# EasyEDA Pro project solar_panel_5v.eprj

# Schematic Schematic1
Board Name: Board1; Create Date: 2026-05-23; Page Name: P1; Project Name: solar_panel_5v; Schematic Name: Schematic1; Update Date: 2026-06-13; Company: EasyEDA.com; Page Size: A4; Version: V1.0
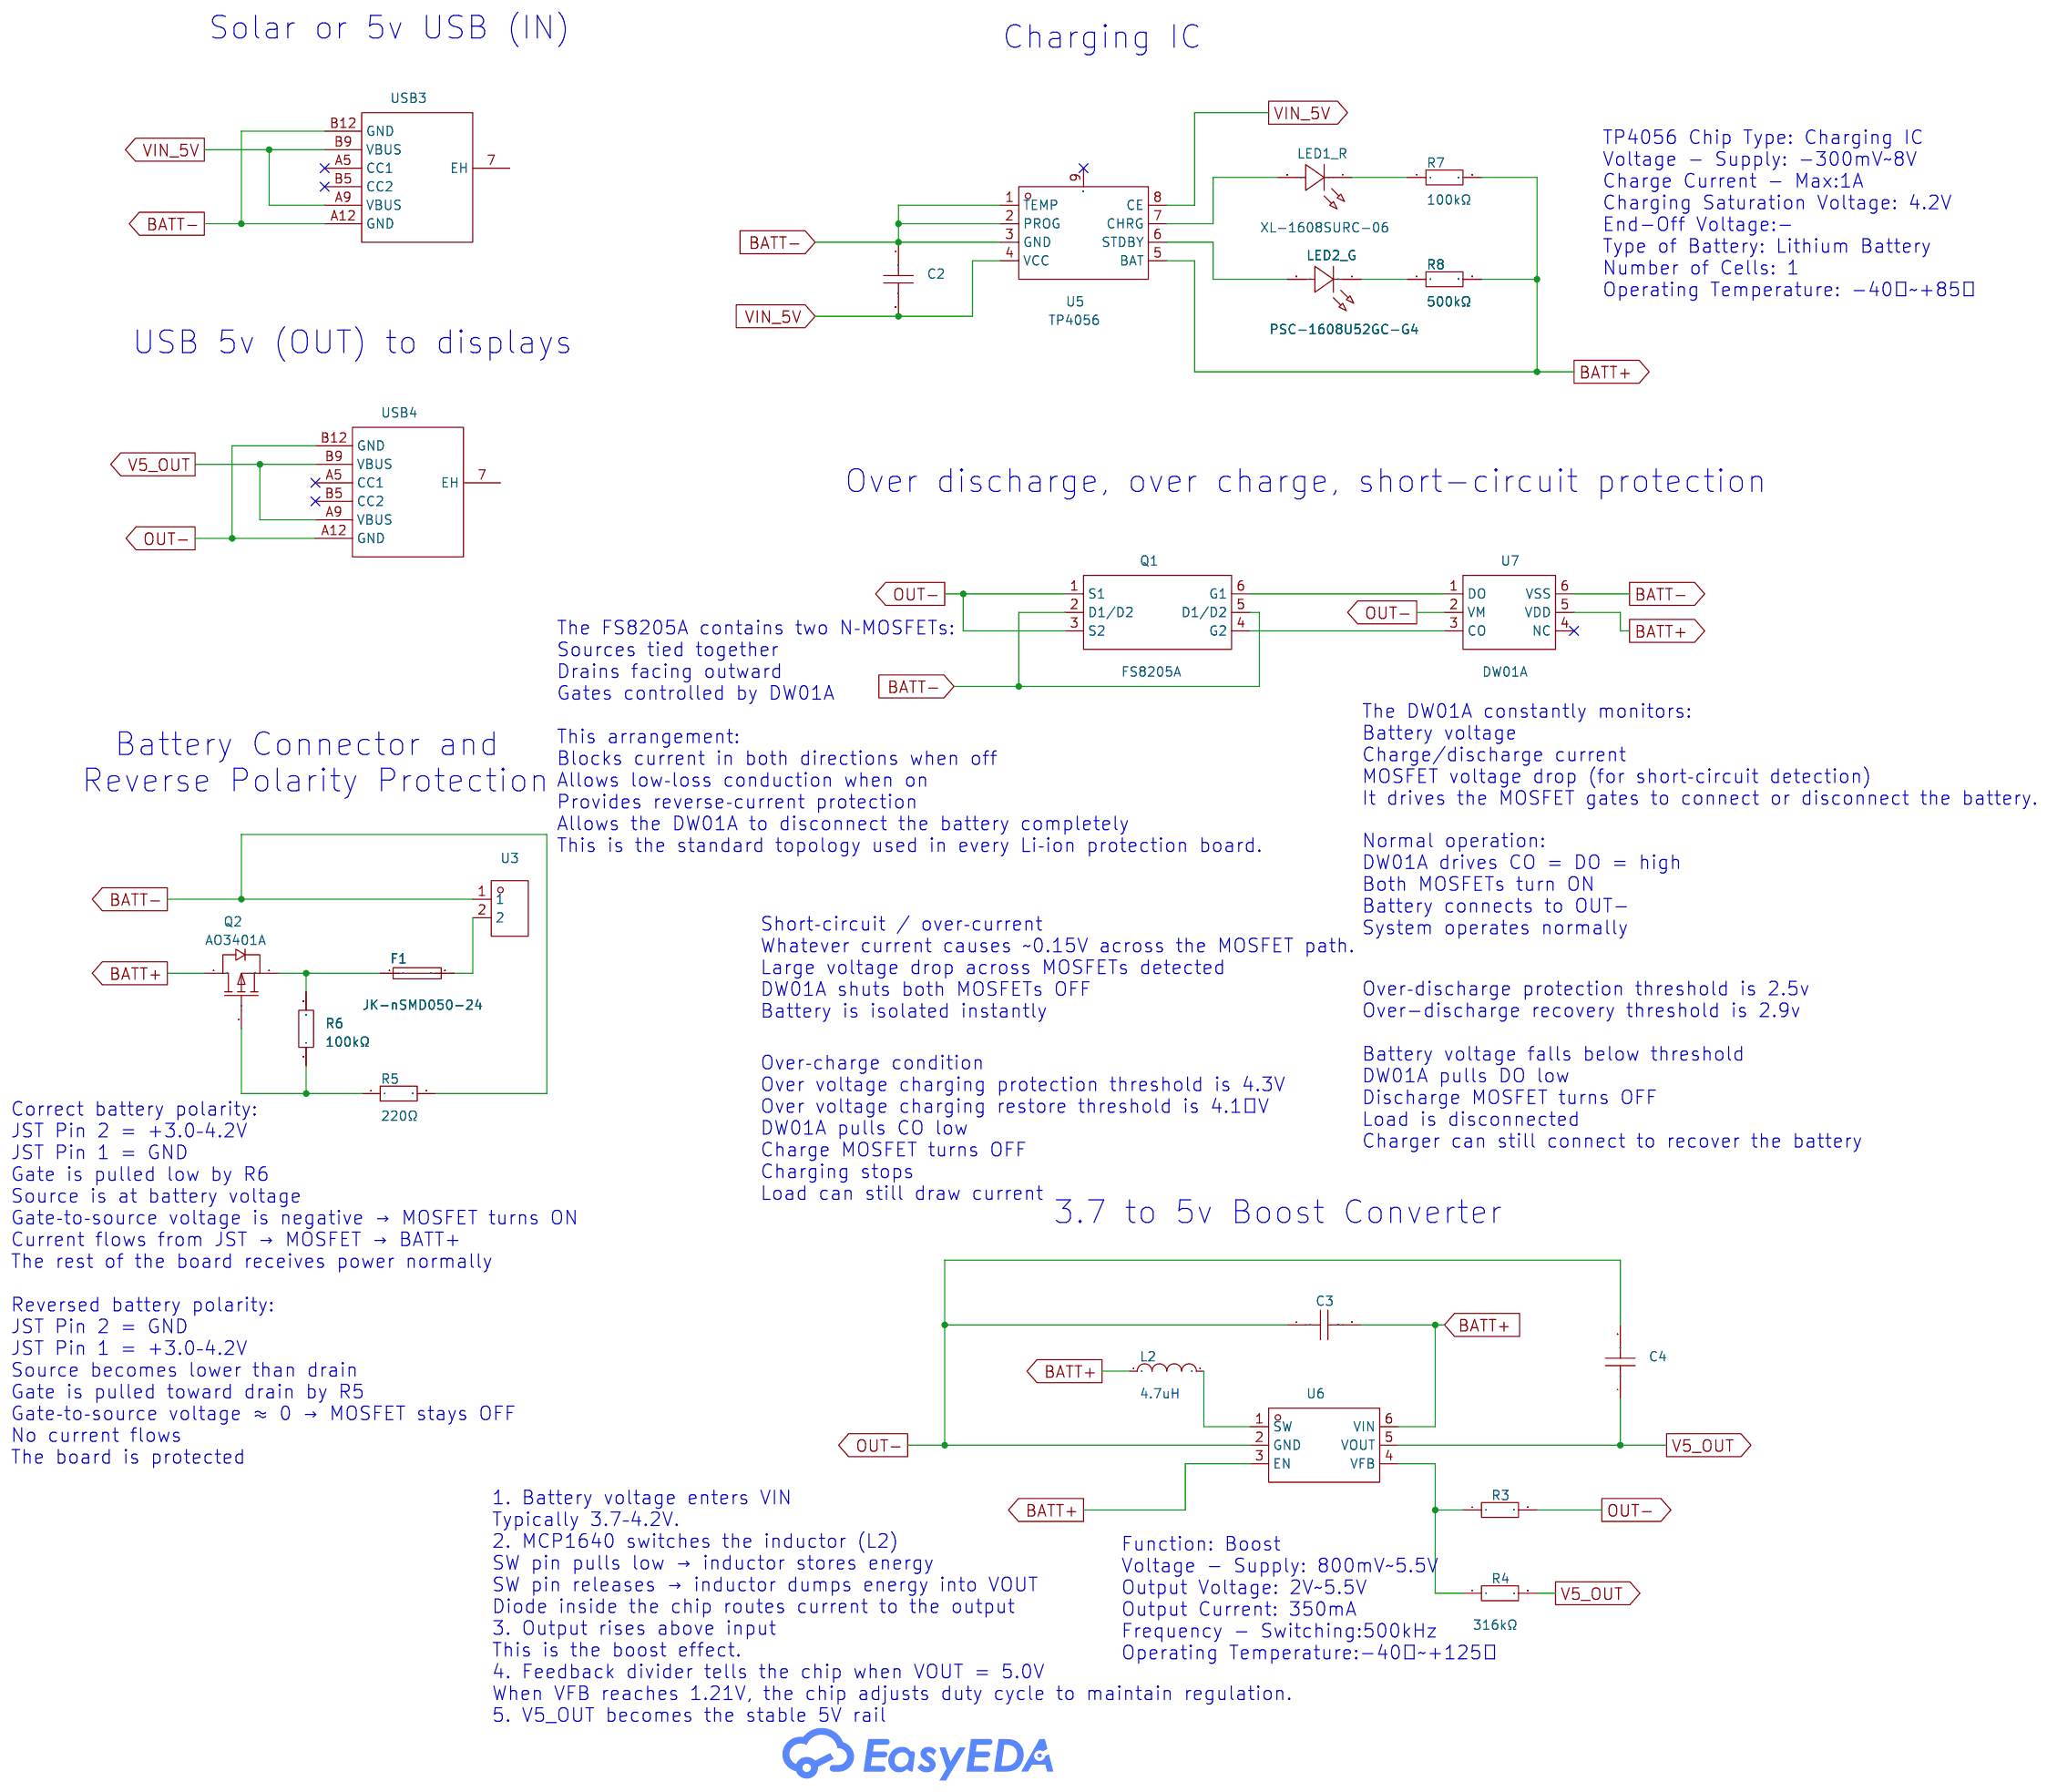
[diagram p0: schematic sheet]

## Parts
C2  10uF  [C0603]
C3  10uF  [C0603]
C4  10uF  [C0603]
F1  JK-nSMD050-24  [F1206]
L2  4.7uH  [L0805]
LED1_R  XL-1608SURC-06  [LED0603-RD_RED]
LED2_G  PSC-1608U52GC-G4  [LED0603-RD_GREEN]
Q1  FS8205A  [SOT-23-6_L2.9-W1.6-P0.95-LS2.8-BR]
Q2  AO3401A  [SOT-23_L2.9-W1.3-P1.90-LS2.4-BR]
R3  100kΩ  [R0603]
R4  316kΩ  [R0603]
R5  220Ω  [R0603]
R6  100kΩ  [R0603]
R7  100kΩ  [R0603]
R8  500kΩ  [R0603]
U3  S2B-PH-SM4-TB(LF)(SN)  [CONN-SMD_P2.00_S2B-PH-SM4-TB-LF-SN]
U5  TP4056  [ESOP-8_L4.9-W3.9-P1.27-LS6.0-BL-EP-4]
U6  MCP1640BT-I/CHY  [SOT-23-6_L2.9-W1.6-P0.95-LS2.8-BR]
U7  DW01A  [SOT-23-6_L2.9-W1.6-P0.95-LS2.9-BL]
USB3  TYPE-C 6P  [TYPE-C-SMD_TYPE-C-6P_1]
USB4  TYPE-C 6P  [TYPE-C-SMD_TYPE-C-6P_1]

## Library data of the parts
C2-C4 = C0603B106M007T: Capacitance:10uF Tolerance:±20% Tolerance:±20% Voltage Rating:6.3V Temperature Coefficient:X5R; LCSC Part Name: 10uF ±20% 6.3V; Supplier Part: C7094065; Manufacturer: IHHEC(禾伸堂); Supplier Footprint: 0603; JLCPCB Part Class: Extended Part; Datasheet: https://item.szlcsc.com/datasheet/C0603B106M007T/8060709.html; Supplier: LCSC; Tolerance: ±20%; Voltage Rating: 6.3V; Temperature Coefficient: X5R
F1 = JK-nSMD050-24: LCSC Part Name: 24V 500mA 1206自恢复; Supplier Part: C369160; Manufacturer: JK(金科); Supplier Footprint: 1206; JLCPCB Part Class: Extended Part; Datasheet: https://item.szlcsc.com/datasheet/JK-nSMD050-24/343073.html; Supplier: LCSC; Voltage - Max: 24V; Current - Max: 100A; Hold Current: 500mA; Trip Current: 1A; Resistance - Initial (Ri) (Min): 150mΩ; Resistance - Post Trip (R1) (Max): 750mΩ; Time to Trip(Max): 100ms; Operating Temperature: -40℃~+85℃; Length: 3.5mm; Width: 1.8mm; Height: 0.85mm
L2 = CPY201209T-4R7M-NP: LCSC Part Name: 4.7uH ±20%; Supplier Part: C285965; Manufacturer: Chilisin(奇力新); Supplier Footprint: 0805; JLCPCB Part Class: Extended Part; Datasheet: https://item.szlcsc.com/datasheet/CPY201209T-4R7M-NP/271270.html; Supplier: LCSC; Tolerance: ±20%
LED1_R = XL-1608SURC-06: LCSC Part Name: 0603红色贴片式发光二极管; Supplier Part: C965799; Manufacturer: XINGLIGHT(成兴光); Supplier Footprint: 0603; JLCPCB Part Class: Extended Part; Datasheet: https://item.szlcsc.com/datasheet/XL-1608SURC-06/1051408.html; Supplier: LCSC; Lamp Holder Type: 1.6mm x 0.8mm square LED; Illumination Color: Red; Voltage - Forward(Vf): 2.3V; Power(Watts): 50mW; Forward Current: 20mA; Wavelength - Dominant: 620nm~630nm; Peak Wavelength: 625nm; Diode Configuration: Discrete Diode; Lens Color: Water Clear; Luminous Intensity: 225mcd; Viewing Angle: 120°; Mounting Style: Top-mount; Operating Temperature: -40℃~+85℃
LED2_G = PSC-1608U52GC-G4: LCSC Part Name: 钻孔1608低亮绿灯; Supplier Part: C22371297; Manufacturer: HONGLITRONIC(鸿利光电); Supplier Footprint: 0603; JLCPCB Part Class: Extended Part; Datasheet: https://item.szlcsc.com/datasheet/PSC-1608U52GC-G4/23857064.html; Supplier: LCSC; Illumination Color: Green; Voltage - Forward(Vf): 3.1V; Power(Watts): 66mW; Forward Current: 10mA; Wavelength - Dominant: 517nm~527nm; Diode Configuration: Discrete Diode; Lens Color: Water Clear; Luminous Intensity: 780mcd; Viewing Angle: 130°; Operating Temperature: -40℃~+85℃
Q1 = FS8205A_C908265: LCSC Part Name: 2个N沟道 耐压:20V 电流:6A; Supplier Part: C908265; Manufacturer: FUXINSEMI(富芯森美); Supplier Footprint: SOT-23-6L; JLCPCB Part Class: Extended Part; Datasheet: https://atta.szlcsc.com/upload/public/pdf/source/20201027/C908265_C6F1A5E0FB14735EF799FEF607A99450.pdf; Supplier: LCSC; Type: 2 N-Channel; Drain to Source Voltage: 20V; RDS(on): 18mΩ@4.5V,6A; Pd - Power Dissipation: 1.5W; Gate Threshold Voltage (Vgs(th)@Id): 1.2V; Gate Charge(Qg): 11nC@4.5V; Input Capacitance(Ciss@Vds): 800pF@8V; Reverse Transfer Capacitance (Crss@Vds): 125pF@8V; Operating Temperature: -55℃~+150℃@(Tj)
Q2 = AO3401A_C15127: LCSC Part Name: 1个P沟道 耐压:30V 电流:4A; Supplier Part: C15127; Manufacturer: AOS; Supplier Footprint: SOT-23; JLCPCB Part Class: Basic Part; Datasheet: https://item.szlcsc.com/datasheet/AO3401A/15801.html; Supplier: LCSC; Number: 1 P-Channel; Drain to Source Voltage: 30V; Current - Continuous Drain(Id): 4A; RDS(on): 47mΩ@10V；85mΩ@2.5V；60mΩ@4.5V; Gate Threshold Voltage (Vgs(th)): 900mV; Gate Charge(Qg): 14nC@10V; Input Capacitance(Ciss): 645pF; Reverse Transfer Capacitance (Crss@Vds): 55pF; Output Capacitance(Coss): 80pF
R3 = FRC0603J104 TS: Type:Thick Film Resistor Resistance:100kΩ Tolerance:±5% Tolerance:±5% Power(Watts):100mW Voltage-Supply(Max):75V Temperature Coefficient:±100ppm/℃ Temperature Coefficient:±100ppm/℃ Operating Temperature:-55℃~+155℃ Operating Temperature:-55℃~+155℃; LCSC Part Name: 100kΩ ±5% 100mW 厚膜电阻; Supplier Part: C2907088; Manufacturer: FOJAN(富捷); Supplier Footprint: 0603; JLCPCB Part Class: Extended Part; Supplier: LCSC; Type: Thick Film Resistor; Tolerance: ±5%; Power(Watts): 100mW; Voltage-Supply(Max): 75V; Temperature Coefficient: ±100ppm/℃; Operating Temperature: -55℃~+155℃
R4 = FRC0603F3163TS: Type:Thick Film Resistor Resistance:316kΩ Tolerance:±1% Tolerance:±1% Power(Watts):100mW Voltage-Supply(Max):75V Temperature Coefficient:±100ppm/℃ Temperature Coefficient:±100ppm/℃ Operating Temperature:-55℃~+155℃ Operating Temperature:-55℃~+155℃; LCSC Part Name: 316kΩ ±1% 100mW 厚膜电阻; Supplier Part: C2998125; Manufacturer: FOJAN(富捷); Supplier Footprint: 0603; JLCPCB Part Class: Extended Part; Supplier: LCSC; Type: Thick Film Resistor; Tolerance: ±1%; Power(Watts): 100mW; Voltage-Supply(Max): 75V; Temperature Coefficient: ±100ppm/℃; Operating Temperature: -55℃~+155℃
R5 = SCR0603J220R: Type:Thick Film Resistors Resistance: Tolerance:±5% Tolerance:±5% Power(Watts): Overload Voltage (Max): Operating Temperature Range:-55℃~+155℃ Operating Temperature Range:-55℃~+155℃; LCSC Part Name: 厚膜电阻 220Ω ±5% 100mW; Supplier Part: C3017752; Manufacturer: VO(翔胜); Supplier Footprint: 0603; JLCPCB Part Class: Extended Part; Datasheet: https://atta.szlcsc.com/upload/public/pdf/source/20220513/247AF9639BA21CF93567DC289CCC6A22.pdf; Supplier: LCSC; Type: Thick Film Resistors; Tolerance: ±5%; Operating Temperature Range: -55℃~+155℃
R6 R7 = FCR0603F100K: Type:Thick Film Resistors Resistance: Tolerance:±1% Tolerance:±1% Power(Watts): Overload Voltage (Max): Operating Temperature Range:-55℃~+155℃ Operating Temperature Range:-55℃~+155℃; LCSC Part Name: 100K ±1%; Supplier Part: C5913165; Manufacturer: VO(翔胜); Supplier Footprint: 0603; JLCPCB Part Class: Extended Part; Datasheet: https://atta.szlcsc.com/upload/public/pdf/source/20230428/98B65D379E9BA4CF2A9223D1647B01B6.pdf; Supplier: LCSC; Type: Thick Film Resistors; Tolerance: ±1%; Operating Temperature Range: -55℃~+155℃
R8 = CR165003F: Type:Thick Film Resistor Resistance:500kΩ Tolerance:±1% Tolerance:±1% Power(Watts):100mW Temperature Coefficient:±100ppm/℃ Temperature Coefficient:±100ppm/℃ Operating Temperature:-55℃~+155℃ Operating Temperature:-55℃~+155℃; LCSC Part Name: 厚膜电阻 500kΩ ±1% 100mW; Supplier Part: C4143191; Manufacturer: Meritek; Supplier Footprint: 0603; JLCPCB Part Class: Extended Part; Datasheet: https://item.szlcsc.com/datasheet/CR165003F/4712492.html; Supplier: LCSC; Type: Thick Film Resistor; Tolerance: ±1%; Power(Watts): 100mW; Temperature Coefficient: ±100ppm/℃; Operating Temperature: -55℃~+155℃
U3 = S2B-PH-SM4-TB(LF)(SN): LCSC Part Name: 1x2P 间距:2mm 卧贴 系列:PH; Supplier Part: C295747; Manufacturer: JST; Supplier Footprint: SMD,P=2mm,卧贴; JLCPCB Part Class: Extended Part; Datasheet: https://atta.szlcsc.com/upload/public/pdf/source/20210203/C295747_344B2E64535E381E727D98C302AB61C7.pdf; Supplier: LCSC; Pins Structure: 1x2P; Pitch: 2mm; Mounting Style: Horizontal attachment; Reference Series: PH; Number of Pins: 2P; Number of Rows: 1; Number of PINs Per Row: 2; Current Rating (Max): 2A; Contact Material: Copper alloy; Contact Plating: Tin; Operating Temperature Range: -25℃~+85℃; Rated Voltage (Max): 100V; Plastic Material: PA; Flame Retardant Rating: UL94V-0; Supplementary Features: Auxiliary soldering legs; Colour: Beige; Z-Height of the Board: 5.5mm; X-Length of Bottom Edge on Board (Spacing Line): 7.9mm; Y-Width of Bottom Edge on Board: 8.6mm
U5 = TP4056_C20199357: The Chip Type:Charging IC Voltage - Supply:-300mV~8V Voltage - Supply:-300mV~8V Charge Current - Max:1A Charging Saturation Voltage:4.2V End-Off Voltage:- Type of Battery:Lithium Battery Number of Cells:1 Number of Cells:1 Operating Temperature:-40℃~+85℃; LCSC Part Name: 线性锂电池充电芯片; Supplier Part: C20199357; Manufacturer: YONGYUTAI(永裕泰); Supplier Footprint: ESOP-8; JLCPCB Part Class: Extended Part; Datasheet: https://item.szlcsc.com/datasheet/TP4056/21524593.html; Supplier: LCSC; The Chip Type: Charging IC; Voltage - Supply: -300mV~8V; Charge Current - Max: 1A; Charging Saturation Voltage: 4.2V; Type of Battery: Lithium Battery; Number of Cells: 1; Operating Temperature: -40℃~+85℃; Battery Temperature Detection: Support; Supply Current (Iq): 100uA
U6 = MCP1640BT-I/CHY: LCSC Part Name: 具备真输出断开或输入/输出旁路选项的 0.65V 启动同步升压调节器; Supplier Part: C478087; Manufacturer: MICROCHIP(美国微芯); Supplier Footprint: SOT-23-6; JLCPCB Part Class: Extended Part; Datasheet: https://item.szlcsc.com/datasheet/MCP1640BT-I%252FCHY/485396.html; Supplier: LCSC; Function: Boost; Voltage - Supply: 800mV~5.5V; Output Voltage: 2V~5.5V; Output Current: 350mA; Frequency - Switching: 500kHz; Operating Temperature: -40℃~+125℃@(TJ); Synchronous Rectifier: Yes; Number of Outputs: 1; Topology: Boost; Quiescent Current: 19uA; Switch tube (built-in/external): Built-In; Output Type: Adjustable
U7 = DW01A_C42380662: LCSC Part Name: SOT23-6塑封封装锂电池保护IC; Supplier Part: C42380662; Manufacturer: Slkor(萨科微); Supplier Footprint: SOT-23-6; JLCPCB Part Class: Extended Part; Datasheet: https://item.szlcsc.com/datasheet/DW01A/44291671.html; Supplier: LCSC; The Chip Type: Protection IC; Voltage - Supply: 1.5V~10V; End-Off Voltage: 2.5V; Type of Battery: Lithium Battery; Number of Cells: 1; Operating Temperature: -40℃~+85℃; Battery Temperature Detection: Not supported; 0V Battery Charge: Support; Supply Current (Iq): 700nA
USB3 USB4 = TYPE-C 6P: LCSC Part Name: 6P卧贴母座; Supplier Part: C456012; Manufacturer: SHOU HAN(首韩); Supplier Footprint: SMD; JLCPCB Part Class: Extended Part; Datasheet: https://item.szlcsc.com/datasheet/TYPE-C%25206P/458819.html; Supplier: LCSC; Connector Type: Type-C; Gender: Female; Mounting Type: Surface Mount, Right Angle; Number of Contacts: 6P; Number of Ports: 1; Current Rating-Power: 3A; Voltage Rating: 5V; Connect-Disconnect Life: 3,000 Cycles; Detection color: Black; Operating Temperature: -40℃~+85℃

## Nets
V5_OUT: C4.1 R4.2 U6.5(VOUT) USB4.A9(VBUS) USB4.B9(VBUS)
VIN_5V: C2.2 U5.4(VCC) U5.8(CE) USB3.A9(VBUS) USB3.B9(VBUS)
BATT+: C3.2 L2.1 Q2.3(D) R7.2 R8.2 U5.5(BAT) U6.3(EN) U6.6(VIN) U7.5(VDD)
BATT-: C2.1 Q1.2(D1/D2) Q1.5(D1/D2) R5.2 U3.1 U5.1(TEMP) U5.2(PROG) U5.3(GND) U7.6(VSS) USB3.A12(GND) USB3.B12(GND)
OUT-: C3.1 C4.2 Q1.1(S1) Q1.3(S2) R3.2 U6.2(GND) U7.2(VM) USB4.A12(GND) USB4.B12(GND)
$1N2456: Q1.6(G1) U7.1(DO)
$1N2890: Q1.4(G2) U7.3(CO)
$1N2995: L2.2 U6.1(SW)
$1N3037: R3.1 R4.1 U6.4(VFB)
$1N4219: Q2.1(G) R5.1 R6.1
$1N6929: F1.1 Q2.2(S) R6.2
Net-(F1-2): F1.2 U3.2
Net-(LED1_R-1): LED1_R.1(K) R7.1
Net-(LED1_R-2): LED1_R.2(A) U5.7(CHRG)
Net-(LED2_G-1): LED2_G.1(K) R8.1
Net-(LED2_G-2): LED2_G.2(A) U5.6(STDBY)

Not connected (* = marked no-connect by the designer): U5 9(PAD)*; U7 4(NC)*; USB3 7(EH) A5(CC1)* B5(CC2)*; USB4 7(EH) A5(CC1)* B5(CC2)*

## Notes on the sheet
- Solar or 5v USB (IN)
- Charging IC
- TP4056 Chip Type: Charging IC
  Voltage - Supply: -300mV~8V
  Charge Current - Max:1A
  Charging Saturation Voltage: 4.2V
  End-Off Voltage:-
  Type of Battery: Lithium Battery
  Number of Cells: 1
  Operating Temperature: -40℃~+85℃
- USB 5v (OUT) to displays
- Over discharge, over charge, short-circuit protection
- The FS8205A contains two N‑MOSFETs:
  Sources tied together
  Drains facing outward
  Gates controlled by DW01A
  This arrangement:
  Blocks current in both directions when off
  Allows low‑loss conduction when on
  Provides reverse‑current protection
  Allows the DW01A to disconnect the battery completely
  This is the standard topology used in every Li‑ion protection board.
- The DW01A constantly monitors:
  Battery voltage
  Charge/discharge current
  MOSFET voltage drop (for short‑circuit detection)
  It drives the MOSFET gates to connect or disconnect the battery.
- Battery Connector and
  Reverse Polarity Protection
- Normal operation:
  DW01A drives CO = DO = high
  Both MOSFETs turn ON
  Battery connects to OUT−
  System operates normally
- Short‑circuit / over‑current
  Whatever current causes ~0.15 V across the MOSFET path.
  Large voltage drop across MOSFETs detected
  DW01A shuts both MOSFETs OFF
  Battery is isolated instantly
- Over‑discharge protection threshold is 2.5v
  Over-discharge recovery threshold is 2.9v
  Battery voltage falls below threshold
  DW01A pulls DO low
  Discharge MOSFET turns OFF
  Load is disconnected
  Charger can still connect to recover the battery
- Over‑charge condition
  Over voltage charging protection threshold is 4.3 V
  Over voltage charging restore threshold is 4.1V
  DW01A pulls CO low
  Charge MOSFET turns OFF
  Charging stops
  Load can still draw current
- Correct battery polarity:
  JST Pin 2 = +3.0–4.2 V
  JST Pin 1 = GND
  Gate is pulled low by R6
  Source is at battery voltage
  Gate‑to‑source voltage is negative → MOSFET turns ON
  Current flows from JST → MOSFET → BATT+
  The rest of the board receives power normally
  Reversed battery polarity:
  JST Pin 2 = GND
  JST Pin 1 = +3.0–4.2 V
  Source becomes lower than drain
  Gate is pulled toward drain by R5
  Gate‑to‑source voltage ≈ 0 → MOSFET stays OFF
  No current flows
  The board is protected
- 3.7 to 5v Boost Converter
- 1. Battery voltage enters VIN
  Typically 3.7–4.2 V.
  2. MCP1640 switches the inductor (L2)
  SW pin pulls low → inductor stores energy
  SW pin releases → inductor dumps energy into VOUT
  Diode inside the chip routes current to the output
  3. Output rises above input
  This is the boost effect.
  4. Feedback divider tells the chip when VOUT = 5.0 V
  When VFB reaches 1.21 V, the chip adjusts duty cycle to maintain regulation.
  5. V5_OUT becomes the stable 5 V rail
- Function: Boost
  Voltage - Supply: 800mV~5.5V
  Output Voltage: 2V~5.5V
  Output Current: 350mA
  Frequency - Switching:500kHz
  Operating Temperature:-40℃~+125℃

# Board PCB1
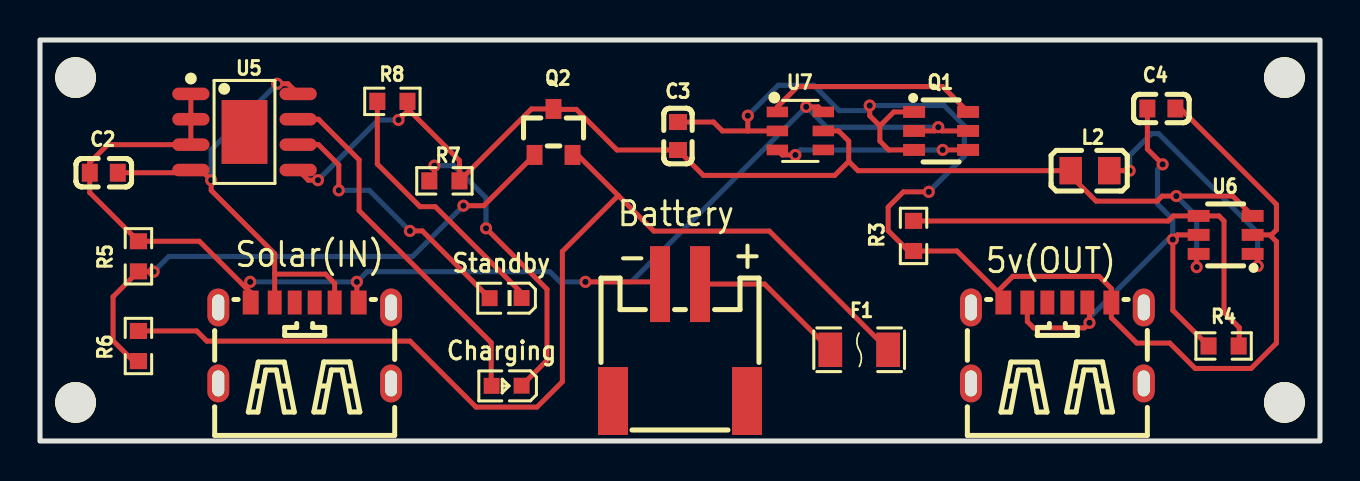
[diagram p1: board, top side]
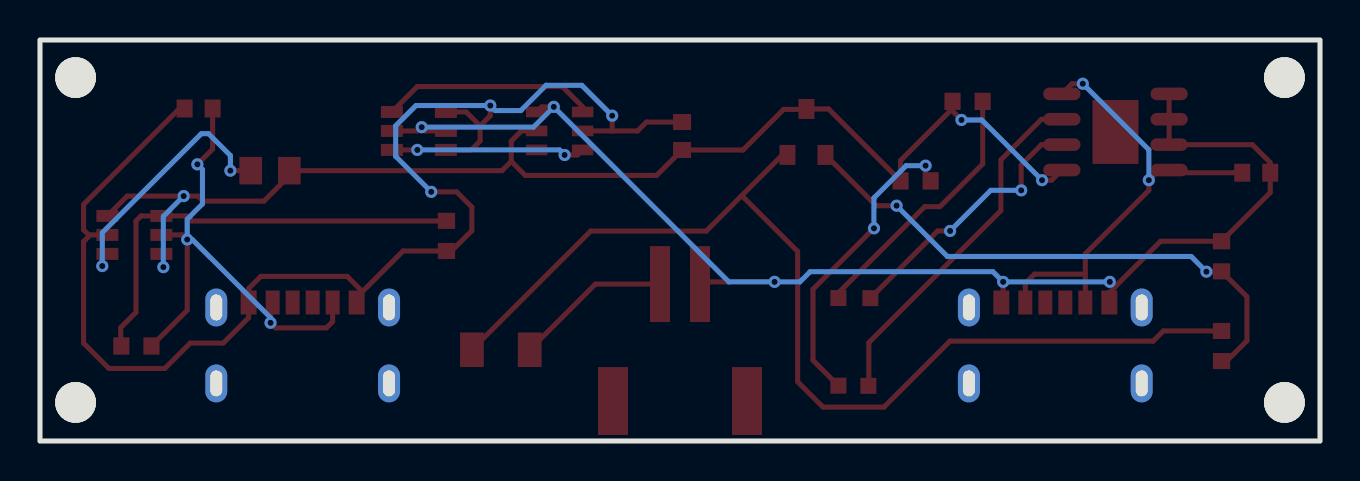
[diagram p2: board, bottom side, seen from below]

Outline 64.01 x 20.07 mm; copper layers: Top Layer, Bottom Layer. Coordinates in mm from the lower left corner of the outline.
Outline path: rectangle 0,20.07 64.01,0
Stack: Top Layer 0.035mm / Dielectric1 1.51mm FR4 er 4.5 / Bottom Layer 0.035mm

## Design rules (mm)
template: Custom Config
spacing copperThickness1oz (default): track to track 0.5, other pairs 0.152 to 0.3
spacing copperThickness2oz: track to track 0.203, other pairs 0.152 to 0.3
track width copperThickness1oz (default): min 0.127, default 0.254, max 2.54
track width copperThickness2oz: min 0.203, default 0.254, max 2.54
differential pair differentialPair (default): width min 0.127, default 0.254, max 2.54; gap min 0.152, default 0.152
via viaSize (default): diameter min 0.5, default 0.61, max 10; hole min 0.3, default 0.305, max 6.3

## Placement (name value [footprint] x y rotation side)
5v(OUT)  TYPE-C 6P  [TYPE-C-SMD_TYPE-C-6P_1]  50.87 4.91 0 top
Battery  S2B-PH-SM4-TB(LF)(SN)  [CONN-SMD_P2.00_S2B-PH-SM4-TB-LF-SN]  32 4.93 0 top
C2  10uF  [C0603]  3.19 13.42 0 top
C3  10uF  [C0603]  31.9 15.26 270 top
C4  10uF  [C0603]  56.08 16.64 0 top
Charging  XL-1608SURC-06  [LED0603-RD_RED]  23.33 2.77 180 top
F1  JK-nSMD050-24  [F1206]  40.96 4.57 180 top
L2  4.7uH  [L0805]  52.51 13.53 0 top
NOREF  -  [Pad_e211]  62.23 18.19 0 top
NOREF#2  -  [Pad_e208]  1.78 18.19 0 top
NOREF#3  -  [Pad_e212]  1.78 1.93 0 top
NOREF#4  -  [Pad_e213]  62.23 1.93 0 top
Q1  FS8205A  [SOT-23-6_L2.9-W1.6-P0.95-LS2.8-BR]  45.06 15.52 180 top
Q2  AO3401A  [SOT-23_L2.9-W1.3-P1.90-LS2.4-BR]  25.68 15.46 270 top
R3  100kΩ  [R0603]  43.68 10.26 270 top
R4  316kΩ  [R0603]  59.19 4.75 180 top
R5  220Ω  [R0603]  4.92 9.24 90 top
R6  100kΩ  [R0603]  4.92 4.75 90 top
R7  100kΩ  [R0603]  20.22 13.02 0 top
R8  500kΩ  [R0603]  17.62 16.99 0 top
Solar(IN)  TYPE-C 6P  [TYPE-C-SMD_TYPE-C-6P_1]  13.24 4.91 0 top
Standby  PSC-1608U52GC-G4  [LED0603-RD_GREEN]  23.28 7.15 180 top
U5  TP4056  [ESOP-8_L4.9-W3.9-P1.27-LS6.0-BL-EP-4]  10.23 15.46 270 top
U6  MCP1640BT-I/CHY  [SOT-23-6_L2.9-W1.6-P0.95-LS2.8-BR]  59.29 10.31 0 top
U7  DW01A  [SOT-23-6_L2.9-W1.6-P0.95-LS2.9-BL]  38.02 15.52 270 top

## Footprints (pads in the part's own frame, mm; a bottom-side part is the same pattern mirrored in y, then rotated)
C0603
  rect 0.8x0.9 smd: 1(-0.7,0) 2(0.7,0)
CONN-SMD_P2.00_S2B-PH-SM4-TB-LF-SN
  rect 1x3.8 smd: 1(-1,2.925) 2(1,2.925)
  rect 1.5x3.4 smd: 3(3.35,-2.925) 4(-3.35,-2.925)
ESOP-8_L4.9-W3.9-P1.27-LS6.0-BL-EP-4
  oval 0.63x1.865 smd: 1(-1.905,-2.683) 2(-0.635,-2.683) 3(0.635,-2.683) 4(1.905,-2.683) 5(1.905,2.683) 6(0.635,2.683) 7(-0.635,2.683) 8(-1.905,2.683)
  rect 3.2x2.3 smd: 9(0,0)
F1206
  rect 1.19x1.728 smd: 1(-1.445,0) 2(1.445,0)
L0805
  rect 1.133x1.377 smd: 1(-0.966,0) 2(0.966,0)
LED0603-RD_GREEN
  rect 0.8x0.8 smd: 1(-0.799,-0.004) 2(0.799,0.004)
LED0603-RD_RED
  rect 0.8x0.8 smd: 1(-0.749,-0.004) 2(0.749,0.004)
Pad_e208
  round 2.032 hole 2.032: 1(0,0)
Pad_e211
  round 2.032 hole 2.032: 2(0,0)
Pad_e212
  round 2.032 hole 2.032: 3(0,0)
Pad_e213
  round 2.032 hole 2.032: 4(0,0)
R0603
  rect 0.806x0.864 smd: 1(-0.753,0) 2(0.753,0)
SOT-23-6_L2.9-W1.6-P0.95-LS2.8-BR
  rect 1.1x0.6 smd: 1(1.35,-0.95) 2(1.35,0) 3(1.35,0.95) 4(-1.35,0.95) 5(-1.35,0) 6(-1.35,-0.95)
SOT-23-6_L2.9-W1.6-P0.95-LS2.9-BL
  rect 0.532x1.072 smd: 1(-0.95,-1.149) 2(0,-1.149) 3(0.95,-1.149) 4(0.95,1.149) 5(0,1.149) 6(-0.95,1.149)
SOT-23_L2.9-W1.3-P1.90-LS2.4-BR
  rect 1x0.8 smd: 1(1.15,-0.95) 2(1.15,0.95) 3(-1.15,0)
TYPE-C-SMD_TYPE-C-6P_1
  oval 1.1x1.9 hole 0.6x1.3: 7(-4.32,1.775) 7(-4.32,-2.025) 7(4.32,1.775) 7(4.32,-2.025)
  rect 0.7x1.2 smd: A5(-0.5,2.025) A9(1.5,2.025) B5(0.5,2.025) B9(-1.5,2.025)
  rect 0.8x1.2 smd: A12(2.7,2.025) B12(-2.7,2.025)

## Nets
V5_OUT: 5v(OUT).A9 5v(OUT).B9 C4.1 R4.2 U6.5
VIN_5V: C2.2 Solar(IN).A9 Solar(IN).B9 U5.4 U5.8
BATT+: C3.2 L2.1 Q2.3 R7.2 R8.2 U5.5 U6.3 U6.6 U7.5
BATT-: Battery.1 C2.1 Q1.2 Q1.5 R5.2 Solar(IN).A12 Solar(IN).B12 U5.1 U5.2 U5.3 U7.6
OUT-: 5v(OUT).A12 5v(OUT).B12 C3.1 C4.2 Q1.1 Q1.3 R3.2 U6.2 U7.2
$1N2456: Q1.6 U7.1
$1N2890: Q1.4 U7.3
$1N2995: L2.2 U6.1
$1N3037: R3.1 R4.1 U6.4
$1N4219: Q2.1 R5.1 R6.1
$1N5372: R8.1 Standby.1
$1N5374: Charging.1 R7.1
$1N5378: Charging.2 U5.7
$1N5384: Standby.2 U5.6
$1N6929: F1.1 Q2.2 R6.2
$1N6933: Battery.2 F1.2

Pads without a net: 5v(OUT) 7 A5 B5; Battery 3 4; NOREF 2; NOREF#2 1; NOREF#3 3; NOREF#4 4; Solar(IN) 7 A5 B5; U5 9; U7 4

## Via types
v1: diameter 0.61, hole 0.305, Top Layer to Bottom Layer, 27 vias

## Routing (per net, layer and track width the routed paths; a pad name or vN(x,y) marks a point on that pad's centre or on a via; arc(x,y) is an arc through that point)
V5_OUT: length 26.1
  Top Layer w0.254: R4.2 56.65,6.54 v1(56.65,10.08) 56.88,10.31 U6.5 ; 5v(OUT).B9 49.37,5.97 49.69,5.66 52.23,5.66 v1(52.48,5.92) 52.48,6.83 5v(OUT).A9 ; C4.1 55.38,14.61 v1(56.14,13.84)
  Bottom Layer w0.254: v1(52.48,5.92) 52.48,6.17 56.39,10.08 v1(56.65,10.08) 56.65,11.1 55.88,11.86 55.88,13.59 v1(56.14,13.84)
VIN_5V: length 24
  Top Layer w0.254: C2.2 7.41,13.42 U5.4 8.05,13.56 v1(8.56,13.05) 8.56,12.54 11.74,9.37 11.74,8.35 ; U5.8 12.4,17.88 v1(11.86,17.88) ; Solar(IN).A9 14.74,7.89 14.28,8.35 11.74,8.35 ; 11.74,8.35 Solar(IN).B9
  Bottom Layer w0.254: v1(8.56,13.05) 8.56,14.58 v1(11.86,17.88)
BATT+: length 63.7
  Top Layer w0.254: 18.44,16.57 20.98,14.03 R7.2 24.57,16.61 Q2.3 25.7,16.59 26.82,16.59 28.85,14.56 C3.2 33.17,13.29 39.74,13.29 40.44,13.99 ; 18.44,16.57 v1(17.93,16.06) ; 18.44,16.57 18.44,16.93 R8.2 ; v1(13.9,13.05) 13.42,13.05 U5.5 ; v1(57.84,8.7) 57.84,9.26 U6.6 ; 40.44,13.99 40.44,15.01 39.93,15.52 U7.5 ; 40.44,13.99 40.91,13.53 L2.1 51.54,13.27 52.81,12 55.86,12 56.11,12.26 v1(56.82,12.26) 59.65,12.26 U6.3
  Bottom Layer w0.254: v1(56.82,12.26) 57.84,11.24 v1(57.84,8.7) ; v1(17.93,16.06) 16.91,16.06 v1(13.9,13.05)
BATT-: length 68
  Top Layer w0.254: U5.1 U5.3 3.39,14.83 2.49,13.93 C2.1 2.49,12.43 R5.2 7.97,10 10.26,7.71 ; Solar(IN).B12 10.54,7.43 10.26,7.71 ; 10.26,7.71 v1(10.51,7.96) ; v1(27.27,7.96) 30.89,7.96 Battery.1 ; U7.6 38.92,16.72 v1(38.32,16.72) ; Q1.2 44.73,15.52 v1(44.92,15.7) 45.11,15.52 Q1.5 ; v1(15.85,7.96) 15.85,7.02 Solar(IN).A12
  Bottom Layer w0.254: v1(44.92,15.7) 39.33,15.7 v1(38.32,16.72) 29.56,7.96 v1(27.27,7.96) 26.01,7.96 25.5,8.47 16.35,8.47 v1(15.85,7.96) v1(10.51,7.96)
OUT-: length 72
  Top Layer w0.254: 35.39,15.52 34.13,15.52 33.68,15.96 C3.1 ; 35.39,15.52 v1(35.39,16.28) ; 35.39,15.52 U7.2 ; 61.58,10.31 61.58,10.23 61.83,9.98 61.83,4.9 60.56,3.63 57.77,3.63 56.5,4.9 54.84,4.9 53.57,6.17 5v(OUT).A12 53.57,7.63 52.96,8.24 48.65,8.24 47.88,7.48 ; 61.58,10.31 61.83,10.57 61.83,11.84 57.03,16.64 C4.2 ; 61.58,10.31 U6.2 ; v1(44.45,12.47) 43.17,12.47 42.41,11.71 42.41,10.52 43.43,9.51 R3.2 45.85,9.51 47.88,7.48 ; 5v(OUT).B12 48.17,7.19 47.88,7.48 ; v1(41.49,16.79) 41.49,16.28 42,15.77 ; 42,15.77 42.7,16.47 Q1.1 ; 42,15.77 42,15.01 42.44,14.57 43.71,14.57
  Bottom Layer w0.254: v1(35.39,16.28) 36.92,17.8 38.7,17.8 39.97,16.53 41.24,16.53 v1(41.49,16.79) 45.21,16.79 46.22,15.77 46.22,14.25 v1(44.45,12.47)
$1N2456: length 10.7
  Top Layer w0.254: U7.1 36.87,16.72 37.89,17.74 45.14,17.74 Q1.6
$1N2890: length 9.7
  Top Layer w0.254: v1(37.77,14.31) 37.13,14.31 36.87,14.57 ; 46.41,14.57 v1(45.14,14.57)
  Bottom Layer w0.254: v1(45.14,14.57) 38.03,14.57 v1(37.77,14.31)
$1N2995: length 13.1
  Top Layer w0.254: U6.1 60.89,9.11 v1(60.89,8.76) ; L2.2 v1(54.49,13.53)
  Bottom Layer w0.254: v1(60.89,8.76) 60.89,10.42 55.94,15.38 55.58,15.38 54.49,14.29 v1(54.49,13.53)
$1N3037: length 22.3
  Top Layer w0.254: R4.1 59.97,4.78 59.97,5.68 59.21,6.44 59.21,11.01 58.95,11.26 U6.4 56.67,11.26 56.42,11.01 43.69,11.01
$1N4219: length 27.9
  Top Layer w0.254: v1(21.17,11.77) 22.19,11.77 Q2.1 ; v1(5.68,8.47) 4.94,8.47 R5.1 3.65,7.22 3.65,5.02 4.67,4 R6.1
  Bottom Layer w0.254: v1(21.17,11.77) 18.63,9.23 6.44,9.23 v1(5.68,8.47)
$1N5372: length 13.3
  Top Layer w0.254: Standby.1 24.08,7.41 19.76,11.73 19,11.73 16.87,13.86 R8.1
$1N5374: length 15.3
  Top Layer w0.254: R7.1 19.72,13.27 v1(19.72,13.78) ; v1(22.3,10.64) 25.35,7.59 25.35,4.04 Charging.1
  Bottom Layer w0.254: v1(19.72,13.78) 20.69,13.78 22.3,12.17 v1(22.3,10.64)
$1N5378: length 17.9
  Top Layer w0.254: 12.91,16.1 13.93,16.1 15.96,14.07 15.96,11.53 22.56,4.92 22.56,2.79 22.58,2.76
$1N5384: length 13.5
  Top Layer w0.254: Standby.2 19.12,10.51 v1(18.5,10.51) ; v1(14.94,12.54) 14.94,13.81 13.93,14.83 U5.6
  Bottom Layer w0.254: v1(14.94,12.54) 16.47,12.54 v1(18.5,10.51)
$1N6929: length 53.6
  Top Layer w0.254: R6.2 7.83,5.51 8.34,5 18.5,5 21.8,1.7 24.85,1.7 26.12,2.97 26.12,9.49 28.92,12.28 ; 28.92,12.28 26.88,14.31 Q2.2 ; 28.92,12.28 30.69,10.5 36.47,10.5 F1.1
$1N6933: length 7.9
  Top Layer w0.254: F1.2 36.23,7.85 Battery.2

## Text on the board
Top Silkscreen Layer: - | +
